# EAGLE design temp_controller_devon (EAGLE 7.6.0)
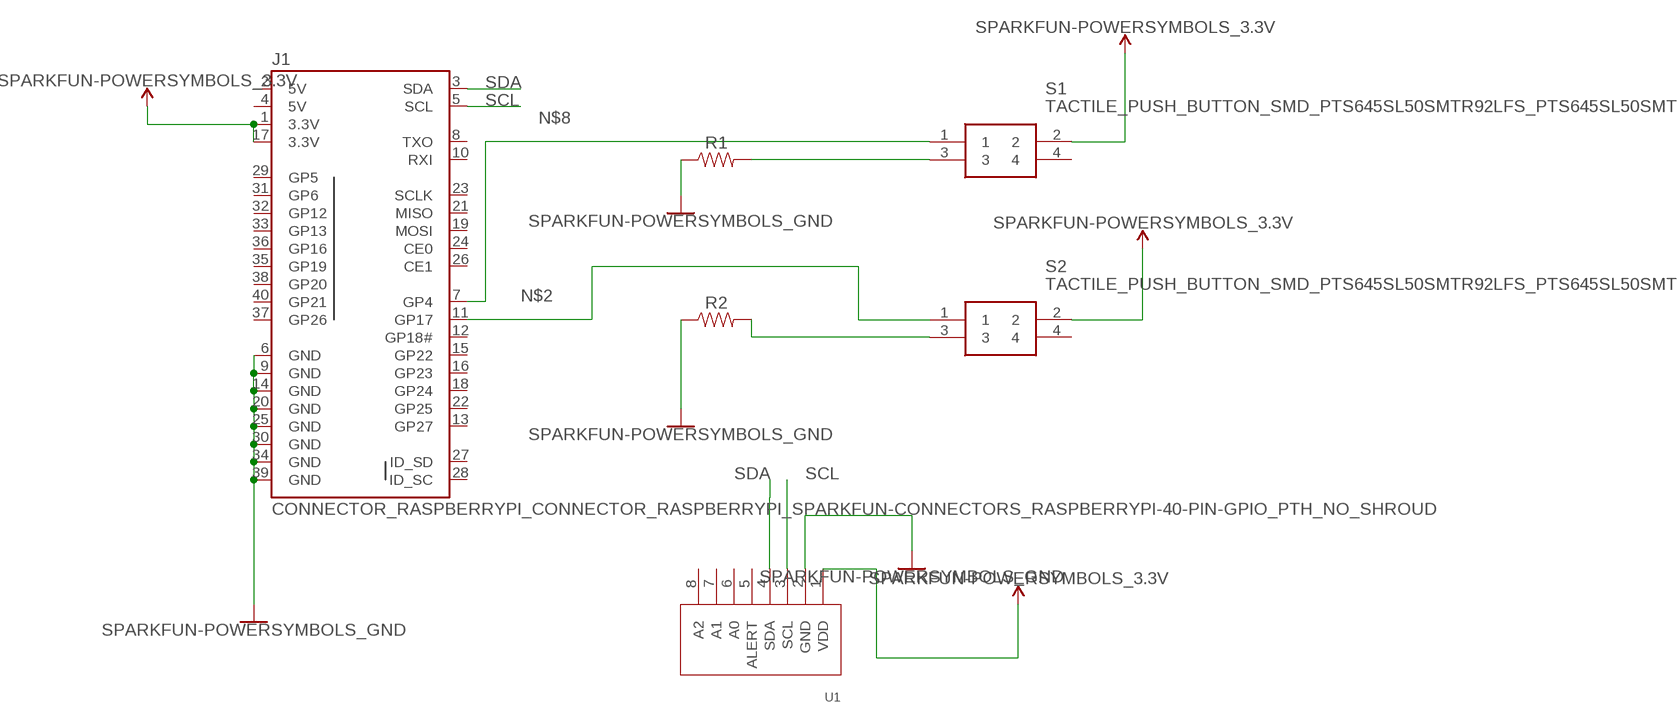
[diagram p0: schematic, sheet 1]

## Parts
J1  CONNECTOR_RASPBERRYPI_CONNECTOR_RASPBERRYPI_SPARKFUN-CONNECTORS_RASPBERRYPI-40-PIN-GPIO_PTH_NO_SHROUD  [CONNECTOR_RASPBERRYPI_CONNECTOR_RASPBERRYPI_SPARKFUN-CONNECTORS_2X20]
R1  LED_SMD_SPARKFUN-RESISTORS_RESISTOR1206  [LED_SMD_SPARKFUN-RESISTORS_1206]
R2  LED_SMD_SPARKFUN-RESISTORS_RESISTOR1206  [LED_SMD_SPARKFUN-RESISTORS_1206]
S1  TACTILE_PUSH_BUTTON_SMD_PTS645SL50SMTR92LFS_PTS645SL50SMTR92LFS  [TACTILE_PUSH_BUTTON_SMD_PTS645SL50SMTR92LFS_PTS645SMT]
S2  TACTILE_PUSH_BUTTON_SMD_PTS645SL50SMTR92LFS_PTS645SL50SMTR92LFS  [TACTILE_PUSH_BUTTON_SMD_PTS645SL50SMTR92LFS_PTS645SMT]
U1  TEMPERATURE_SENSOR_MCP9808  [TEMPERATURE_SENSOR_MCP9808]

## Nets
3.3V: J1.1(3.3V) J1.17(3.3V) S1.2 S2.2 U1.1(VDD) ; supply symbol labelled SPARKFUN-POWERSYMBOLS_3.3V
GND: J1.6(GND) J1.9(GND) J1.14(GND) J1.20(GND) J1.25(GND) J1.30(GND) J1.34(GND) J1.39(GND) R1.1 R2.1 U1.2(GND) ; supply symbol labelled SPARKFUN-POWERSYMBOLS_GND
N$2: J1.11(GP17) S2.1
N$3: R2.2 S2.3
N$5: R1.2 S1.3
N$8: J1.7(GP4) S1.1
SCL: J1.5(SCL) U1.3(SCL)
SDA: J1.3(SDA) U1.4(SDA)
Unconnected: J1.8(TXO) J1.10(RXI) J1.12(GP18#) J1.13(GP27) J1.15(GP22) J1.16(GP23) J1.18(GP24) J1.19(MOSI) J1.21(MISO) J1.22(GP25) J1.23(SCLK) J1.24(CE0) J1.26(CE1) J1.27(ID_SD) J1.28(ID_SC) J1.29(GP5) J1.31(GP6) J1.32(GP12) J1.33(GP13) J1.35(GP19) J1.36(GP16) J1.37(GP26) J1.38(GP20) J1.40(GP21) S1.4 S2.4 U1.5(ALERT) U1.6(A0) U1.7(A1) U1.8(A2)

## Power pins joined to a net without a drawn wire
5V: J1.2(5V) J1.4(5V)

## Library data of the parts
J1 = tempControllerParts:CONNECTOR_RASPBERRYPI_CONNECTOR_RASPBERRYPI_SPARKFUN-CONNECTORS_RASPBERRYPI-40-PIN-GPIO: Raspberry Pi GPIO Header 2x20 pin connector, as found on B, B+, A+ models. Both shrouded PTH and SMT versions available. SparkFun Products: GPIO Shrouded Header <https://www.sparkfun.com/products/13054>- PTH SparkFun Pi Wedge (Preassembled) <https://www.sparkfun.com/products/13717>; PROD_ID: CONN-13143; SF_ID: PRT-13054
R1 R2 = tempControllerParts:LED_SMD_SPARKFUN-RESISTORS_RESISTOR: Generic Resistor Package
S1 S2 = tempControllerParts:TACTILE_PUSH_BUTTON_SMD_PTS645SL50SMTR92LFS_PTS645SL50SMTR92LFS: PTS645SL50SMTR92LFS (Tactile Switches) Source: Datasheet <https://www.ckswitches.com/media/1471/pts645.pdf>; DESCRIPTION: PTS645SL50SMTR92LFS (Tactile Switches); HEIGHT: mm; MANUFACTURER_NAME: C & K COMPONENTS; MANUFACTURER_PART_NUMBER: PTS645SL50SMTR92LFS; MOUSER_PART_NUMBER: 611-PTS645SL50SMTR92; MOUSER_PRICE-STOCK: https://www.mouser.com/Search/Refine.aspx?Keyword=611-PTS645SL50SMTR92
U1 = tempControllerParts:TEMPERATURE_SENSOR_MCP9808

## Board
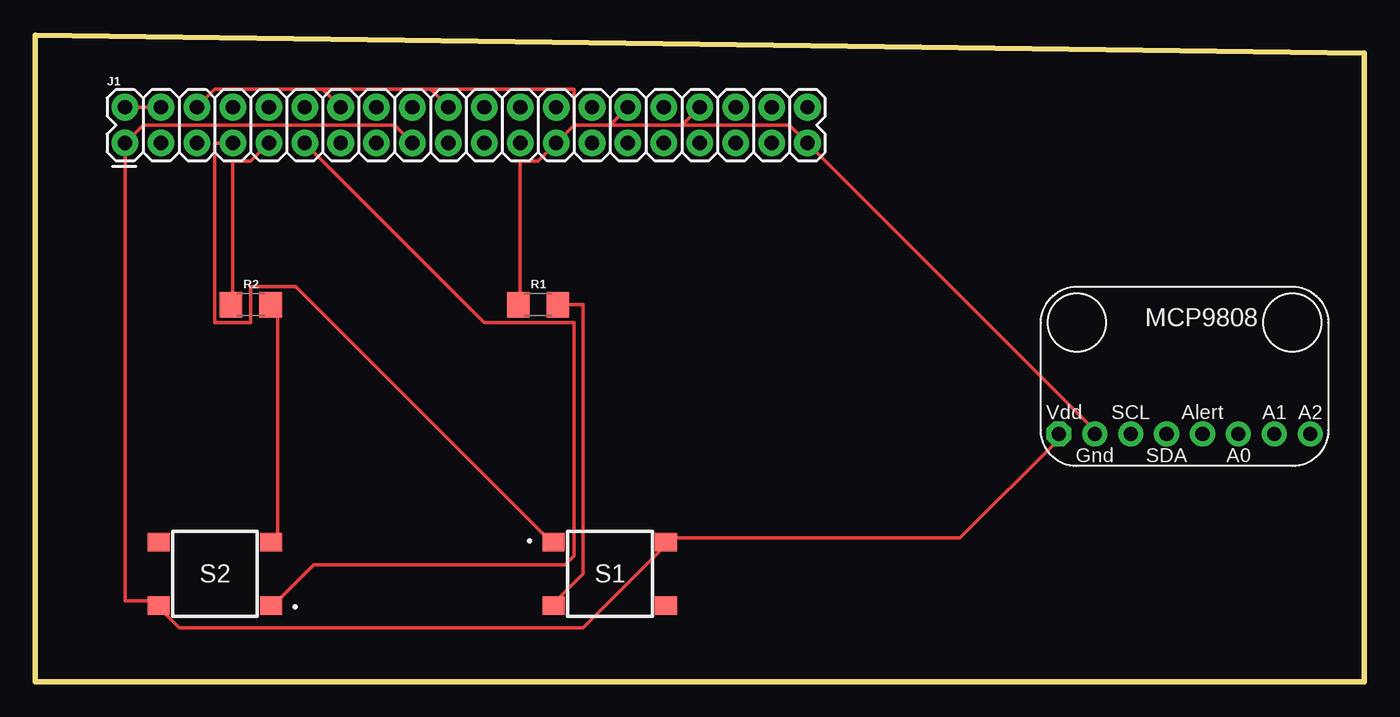
[diagram p1: board, top side]
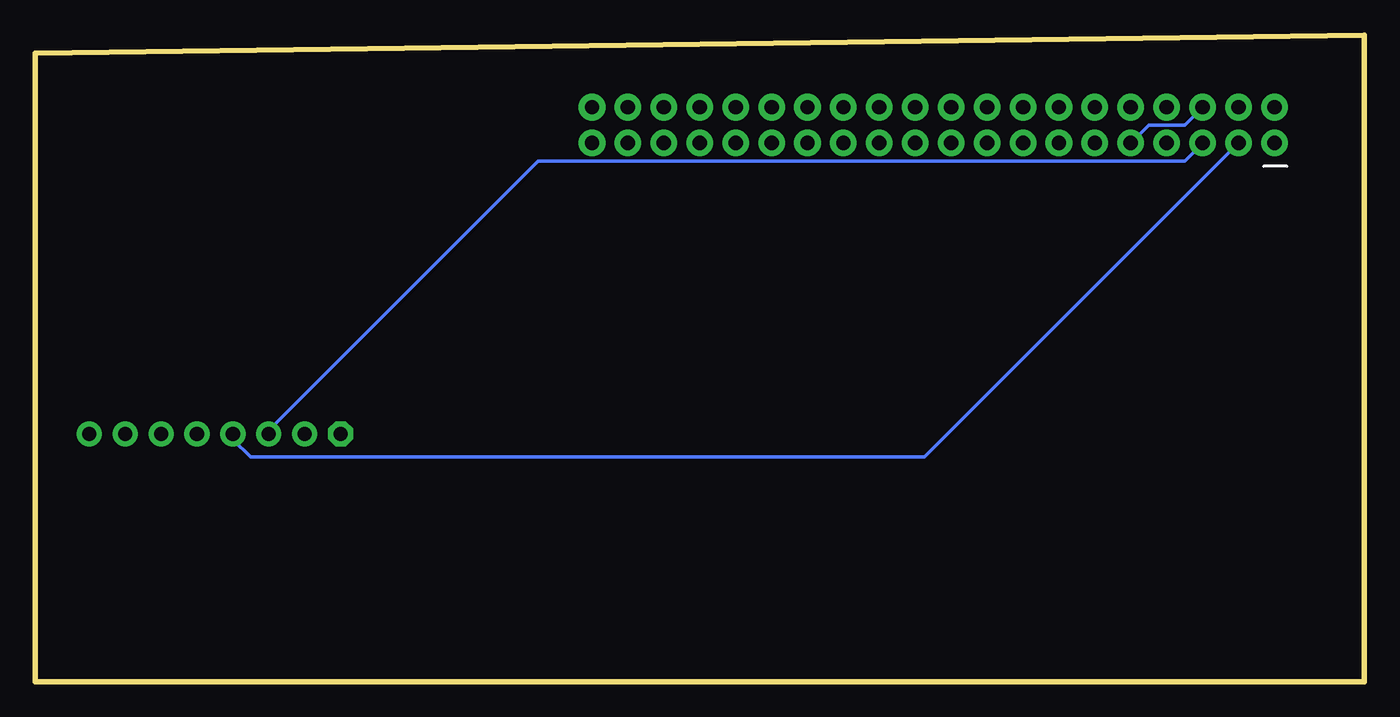
[diagram p2: board, bottom side, seen from below]

Size 93.98 x 45.72 mm. Coordinates in mm from the lower left corner, seen from the top.
Outline: 0,0 93.98,0 93.98,44.45 0,45.72 0,0
Copper layers (1*16): Top 0.035mm / dielectric 1.5mm / Bottom 0.035mm
Design rules "default": minimum track width 10mil, minimum drill 24mil, track to track 8mil, track to pad 8mil, pad to pad 8mil, via to via 8mil, smd to smd 8mil, copper to edge 40mil, drill to drill 8mil, minimum pad ring 10mil, minimum via ring 8mil, stop-mask expansion 4mil, vias tented up to drill 0mil, thermal gap 10mil

### Footprints (pad centres in the part's own frame; a part is rotated, then mirrored left to right if it is on the bottom)
CONNECTOR_RASPBERRYPI_CONNECTOR_RASPBERRYPI_SPARKFUN-CONNECTORS_2X20 = drill 1.016 pad 1.88: 1 -24.13,-1.27; 2 -24.13,1.27; 3 -21.59,-1.27; 4 -21.59,1.27; 5 -19.05,-1.27; 6 -19.05,1.27; 7 -16.51,-1.27; 8 -16.51,1.27; 9 -13.97,-1.27; 10 -13.97,1.27; 11 -11.43,-1.27; 12 -11.43,1.27; 13 -8.89,-1.27; 14 -8.89,1.27; 15 -6.35,-1.27; 16 -6.35,1.27; 17 -3.81,-1.27; 18 -3.81,1.27; 19 -1.27,-1.27; 20 -1.27,1.27; 21 1.27,-1.27; 22 1.27,1.27; 23 3.81,-1.27; 24 3.81,1.27; 25 6.35,-1.27; 26 6.35,1.27; 27 8.89,-1.27; 28 8.89,1.27; 29 11.43,-1.27; 30 11.43,1.27; 31 13.97,-1.27; 32 13.97,1.27; 33 16.51,-1.27; 34 16.51,1.27; 35 19.05,-1.27; 36 19.05,1.27; 37 21.59,-1.27; 38 21.59,1.27; 39 24.13,-1.27; 40 24.13,1.27
LED_SMD_SPARKFUN-RESISTORS_1206 = smd 1.6 x 1.8: 1 -1.4,0; 2 1.4,0
TACTILE_PUSH_BUTTON_SMD_PTS645SL50SMTR92LFS_PTS645SMT = smd 1.55 x 1.3: 1 -3.975,2.25; 2 3.975,2.25; 3 -3.975,-2.25; 4 3.975,-2.25
TEMPERATURE_SENSOR_MCP9808 = drill 1 pad 1.778 octagon: 1 -8.89,-4.064 | drill 1 pad 1.778: 2 -6.35,-4.064; 3 -3.81,-4.064; 4 -1.27,-4.064; 5 1.27,-4.064; 6 3.81,-4.064; 7 6.35,-4.064; 8 8.89,-4.064

### Placement (x,y rotation side)
J1  30.48,39.37 0 top
R1  35.56,26.67 0 top
R2  15.24,26.67 0 top
S1  40.64,7.62 0 top
S2  12.7,7.62 180 top
U1  81.28,21.59 0 top

### Tracks (layer width: path | path; a pad name or v marks a point on that pad's centre or on a via)
3.3V
  Top 0.254: J1.17 25.4,39.37 7.62,39.37 J1.1 6.35,5.71 8.26,5.71 S2.2 8.89,5.08 10.16,3.81 38.73,3.81 44.45,9.52 S1.2 45.09,10.16 65.41,10.16 72.39,17.14 U1.1
5V
  Top 0.254: J1.4 J1.2
GND
  Top 0.254: U1.2 74.93,17.78 J1.39 53.34,39.37 45.72,39.37 | R1.1 34.29,26.67 34.29,36.83 35.56,36.83 J1.25 38.1,39.37 | 40.64,39.37 J1.30 | 38.1,39.37 40.64,39.37 | 45.72,39.37 J1.34 | 40.64,39.37 45.72,39.37 | J1.9 15.24,36.83 13.97,36.83 13.97,26.67 R2.1 | J1.6 12.7,41.91 20.32,41.91 | J1.14 20.32,41.91 | 27.94,41.91 J1.20 | 20.32,41.91 27.94,41.91 | 38.1,39.37 38.1,41.91 27.94,41.91
  Bottom 0.254: J1.9 15.24,39.37 12.7,39.37 J1.6
N$2
  Top 0.254: J1.11 31.75,25.4 38.1,25.4 38.1,8.89 37.46,8.25 19.69,8.25 17.15,5.71 S2.1
N$3
  Top 0.254: S2.3 17.15,10.16 17.15,26.67 R2.2
N$5
  Top 0.254: R1.2 38.73,26.67 38.73,7.62 36.83,5.71 S1.3
N$8
  Top 0.254: J1.7 12.7,38.1 12.7,25.4 15.24,25.4 15.24,27.94 18.41,27.94 36.2,10.16 S1.1
SCL
  Bottom 0.254: J1.5 12.7,36.83 58.42,36.83 77.47,17.78 U1.3
SDA
  Bottom 0.254: J1.3 31.12,15.88 78.74,15.88 80.01,17.14 U1.4